# EAGLE design iot_ambilamp_rpi_shield (EAGLE 8.5.0)
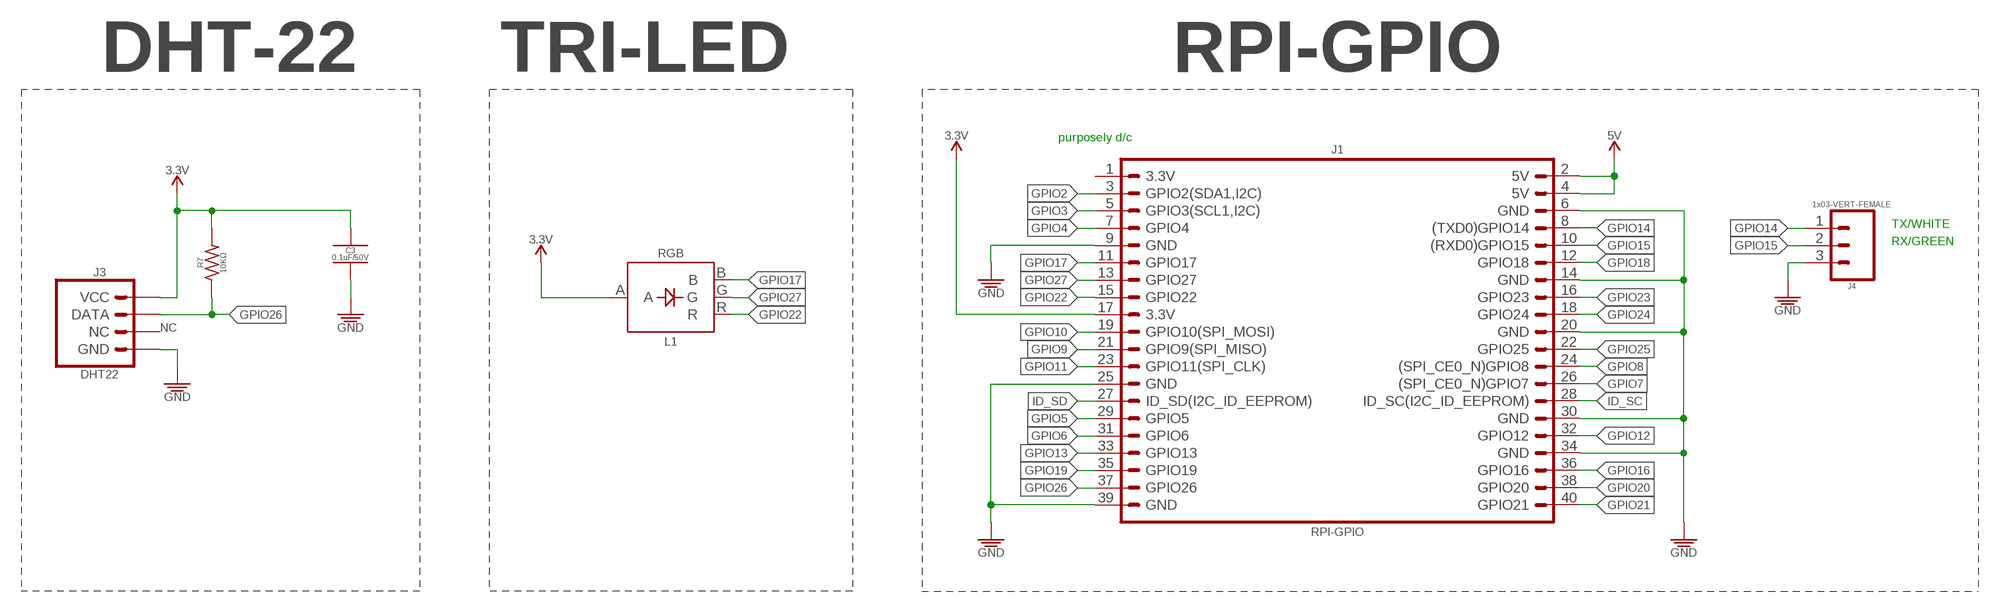
[diagram p0: schematic, sheet 1, part 1 of 2]
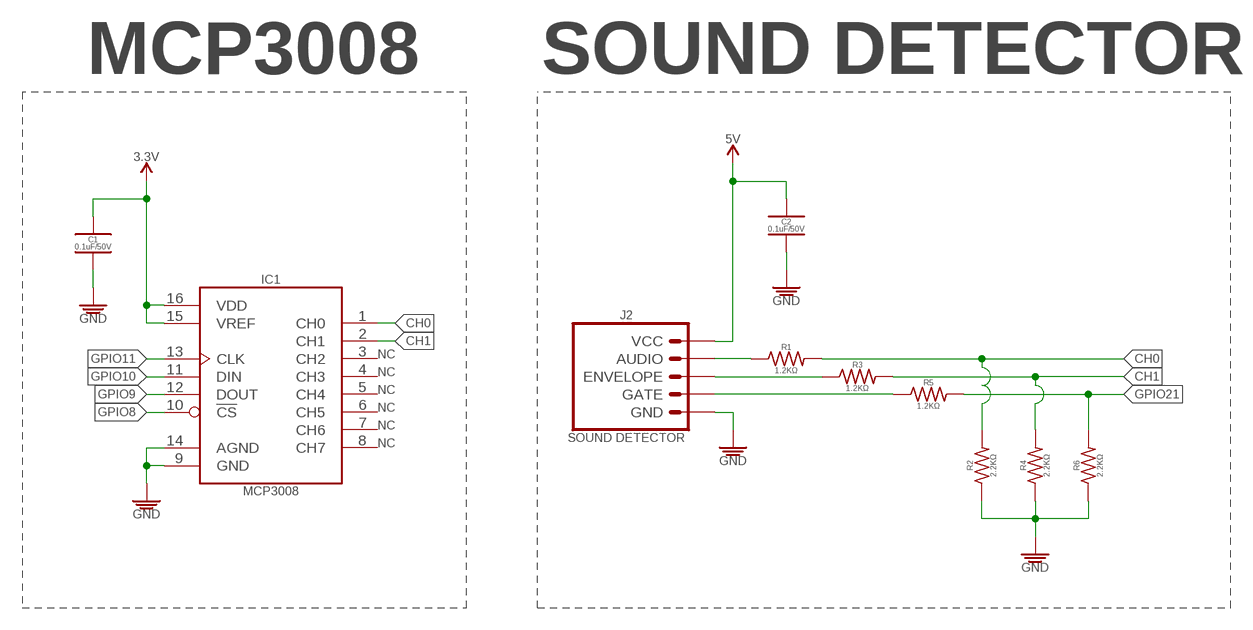
[diagram p1: schematic, sheet 1, part 2 of 2]

## Parts
C1  0.1uF/50V  0.1UF_SMD-805_50V-10%  [_CER_SMD-805]
C2  0.1uF/50V  0.1UF_SMD-805_50V-10%  [_CER_SMD-805]
C3  0.1uF/50V  0.1UF_SMD-805_50V-10%  [_CER_SMD-805]
IC1  MCP3008  MCP3008SO-16  [SO-16]
J1  RPI-GPIO  RPI-GPIO_CONNECTOR  [RPI-GPIO_CONNECTOR_TALL]
J2  SOUND DETECTOR  SOUND-DETECTOR_SPARKFUN  [CONNECTOR-RA_SOUND-DETECTOR_SPARKFUN]
J3  DHT22  TEMPERATURE-SENSOR_DHT22  [CONNECTOR_TEMPERATURE-SENSOR_DHT22]
J4  1x03-VERT-FEMALE  1X03_VERT-FEMALE  [1X03-VERT-FEMALE]
L1  RGB  LED-5MM-PTH_RGB-CA  [LED-5MM-PTH_RGB-CA]
R1  1.2KΩ  1.2KΩ_SMD-0805_1/8W-5%  [RESISTOR_SMD-805]
R2  2.2KΩ  2.2KΩ_SMD-0805_1/8W-5%  [RESISTOR_SMD-805]
R3  1.2KΩ  1.2KΩ_SMD-0805_1/8W-5%  [RESISTOR_SMD-805]
R4  2.2KΩ  2.2KΩ_SMD-0805_1/8W-5%  [RESISTOR_SMD-805]
R5  1.2KΩ  1.2KΩ_SMD-0805_1/8W-5%  [RESISTOR_SMD-805]
R6  2.2KΩ  2.2KΩ_SMD-0805_1/8W-5%  [RESISTOR_SMD-805]
R7  10KΩ  10KΩ_SMD-0805_1/8W-5%  [RESISTOR_SMD-805]

## Nets
3.3V: C1.1 C3.1 IC1.15(VREF) IC1.16(VDD) J1.17(3.3V) J3.VCC L1.A R7.2
5V: C2.1 J1.2(5V) J1.4(5V) J2.VCC
CH0: IC1.1(CH0) R1.2 R2.2
CH1: IC1.2(CH1) R3.2 R4.2
GND: C1.2 C2.2 C3.2 IC1.9(GND) IC1.14(AGND) J1.6(GND) J1.9(GND) J1.14(GND) J1.20(GND) J1.25(GND) J1.30(GND) J1.34(GND) J1.39(GND) J2.GND J3.GND J4.3 R2.1 R4.1 R6.1
GPIO2: J1.3(GPIO2(SDA1,I2C))
GPIO3: J1.5(GPIO3(SCL1,I2C))
GPIO4: J1.7(GPIO4)
GPIO5: J1.29(GPIO5)
GPIO6: J1.31(GPIO6)
GPIO7: J1.26((SPI_CE0_N)GPIO7)
GPIO8: IC1.10(!CS) J1.24((SPI_CE0_N)GPIO8)
GPIO9: IC1.12(DOUT) J1.21(GPIO9(SPI_MISO))
GPIO10: IC1.11(DIN) J1.19(GPIO10(SPI_MOSI))
GPIO11: IC1.13(CLK) J1.23(GPIO11(SPI_CLK))
GPIO12: J1.32(GPIO12)
GPIO13: J1.33(GPIO13)
GPIO14: J1.8((TXD0)GPIO14) J4.1
GPIO15: J1.10((RXD0)GPIO15) J4.2
GPIO16: J1.36(GPIO16)
GPIO17: J1.11(GPIO17) L1.B
GPIO18: J1.12(GPIO18)
GPIO19: J1.35(GPIO19)
GPIO20: J1.38(GPIO20)
GPIO21: J1.40(GPIO21) R5.2 R6.2
GPIO22: J1.15(GPIO22) L1.R
GPIO23: J1.16(GPIO23)
GPIO24: J1.18(GPIO24)
GPIO25: J1.22(GPIO25)
GPIO26: J1.37(GPIO26) J3.DATA R7.1
GPIO27: J1.13(GPIO27) L1.G
ID_SC: J1.28(ID_SC(I2C_ID_EEPROM))
ID_SD: J1.27(ID_SD(I2C_ID_EEPROM))
N$5: J2.GATE R5.1
N$6: J2.ENVELOPE R3.1
N$7: J2.AUDIO R1.1
Unconnected: IC1.3(CH2) IC1.4(CH3) IC1.5(CH4) IC1.6(CH5) IC1.7(CH6) IC1.8(CH7) J1.1(3.3V) J3.NC

## Notes on the sheet
- DHT-22 | TRI-LED | RPI-GPIO | MCP3008 | SOUND DETECTOR
- purposely d/c
- TX/WHITE
- RX/GREEN
- NC
- NC
- NC
- NC
- NC
- NC

## Library data of the parts
C1-C3 = PiB_capacitors:0.1UF; CREATOR: MrSwirlyEyes; DATASHEET: http://psearch.en.murata.com/capacitor/product/GRM21BR71H104KA01%23.pdf; DIST: Digikey; DISTLINK: https://www.digikey.com/products/en?keywords=490-1666-1-ND; DISTPN: 490-1666-1-ND; MFR: Murata Electronics North America; MPN: GRM21BR71H104KA01L; TESTED: NO
IC1 = PiB:MCP3008; CREATOR: MrSwirlyEyes; DATASHEET: http://ww1.microchip.com/downloads/en/DeviceDoc/21295d.pdf; DIST: Digikey; DISTLINK: https://www.digikey.com/products/en?keywords=MCP3008-I%2FSL-ND; DISTPN: MCP3008-I/SL-ND; MFR: Microchip Technology; MPN: MCP3008-I/SL; TESTED: NO
J1 = PiB_connectors:RPI-GPIO_CONNECTOR; CREATOR: MrSwirlyEyes; DATASHEET: https://media.digikey.com/pdf/Data%20Sheets/Sparkfun%20PDFs/PRT-14017_Web.pdf; DIST: Digikey; DISTLINK: https://www.digikey.com/products/en?keywords=1568-1462-ND; DISTPN: 1568-1462-ND; MFR: Sparkfun Electronics; MPN: PRT-14017; TESTED: NO
J2 = lib_swirly:SOUND-DETECTOR_SPARKFUN; CREATOR: MrSwirlyEyes; DATASHEET: https://learn.sparkfun.com/tutorials/sound-detector-hookup-guide; DATASHEET_CONNECTOR: http://www.sullinscorp.com/catalogs/77_PAGE108-109_.100_MALE_HDR.pdf; DIST: Digikey; DISTLINK: https://www.digikey.com/products/en?keywords=1568-1290-ND; DISTLINK_CONNECTOR: https://www.digikey.com/products/en?keywords=PEC05SAAN; DISTPN: 1568-1290-ND; DISTPN_CONNECTOR: S1012E-05-ND; DIST_CONNECTOR: Digikeu; MFR: Sparkfun; MFR_CONNECTOR: Sullins Connector Solutions; MPN: SEN-12642; MPN_CONNECTOR: PEC05SAAN; TESTED: NO
J3 = PiB:TEMPERATURE-SENSOR_DHT22; CREATOR: MrSwirlyEyes; DATASHEET: https://cdn-shop.adafruit.com/datasheets/DHT22.pdf; DIST: Sparkfun; DISTLINK: https://www.sparkfun.com/products/10167; DISTPN: SEN-10167; MFR: MaxDetect Technology Co., Ltd.; MPN: RHT03; TESTED: NO
J4 = PiB_connectors:1X03; CREATOR: MrSwirlyEyes; DATASHEET: http://sullinscorp.com/catalogs/101_PAGE114-115_.100_FEMALE_HDR.pdf; DIST: Digikey; DISTLINK: https://www.digikey.com/products/en?keywords=PPTC031LFBN-RC; DISTPN: S7001-ND; MFR: Sullins Connector Solutions; MPN: PPTC031LFBN-RC; TESTED: NO
L1 = PiB_leds:LED-5MM-PTH_RGB-CA; CREATOR: MrSwirlyEyes; DATASHEET: https://cdn.sparkfun.com/datasheets/Components/LED/YSL-R596AR3G4B5C-C10.pdf; DIST: Sparkfun; DISTLINK: https://www.sparkfun.com/products/10820; DISTPN: COM-10820; MFR: SunLED; MPN: YSL-R596AR3G4B5C-C10; TESTED: NO
R1 R3 R5 = PiB_resistors:1.2KΩ; CREATOR: MrSwirlyEyes; DATASHEET: http://www.yageo.com/documents/recent/PYu-RC_Group_51_RoHS_L_7.pdf; DIST: Digikey; DISTLINK: https://www.digikey.com/product-detail/en/yageo/RC0805JR-071K2L/311-1.2KARCT-ND/731171; DISTPN: 311-1.2KARCT-ND; MFR: Yageo; MPN: RC0805JR-071K2L; TESTED: NO
R2 R4 R6 = PiB_resistors:2.2KΩ; CREATOR: MrSwirlyEyes; DATASHEET: http://www.yageo.com/documents/recent/PYu-RC_Group_51_RoHS_L_7.pdf; DIST: Digikey; DISTLINK: https://www.digikey.com/product-detail/en/yageo/RC0805JR-072K2L/311-2.2KARCT-ND/731218; DISTPN: 311-2.2KARCT-ND; MFR: Yageo; MPN: RC0805JR-072K2L; TESTED: NO
R7 = PiB_resistors:10KΩ; CREATOR: Kenmei; DATASHEET: http://www.yageo.com/documents/recent/PYu-RC_Group_51_RoHS_L_7.pdf; DIST: Digikey; DISTLINK: https://www.digikey.com/products/en?keywords=311-10KARCT-ND; DISTPN: 311-10KARCT-ND; MFR: Yageo; MPN: RC0805JR-0710KL; TESTED: YES

## Board
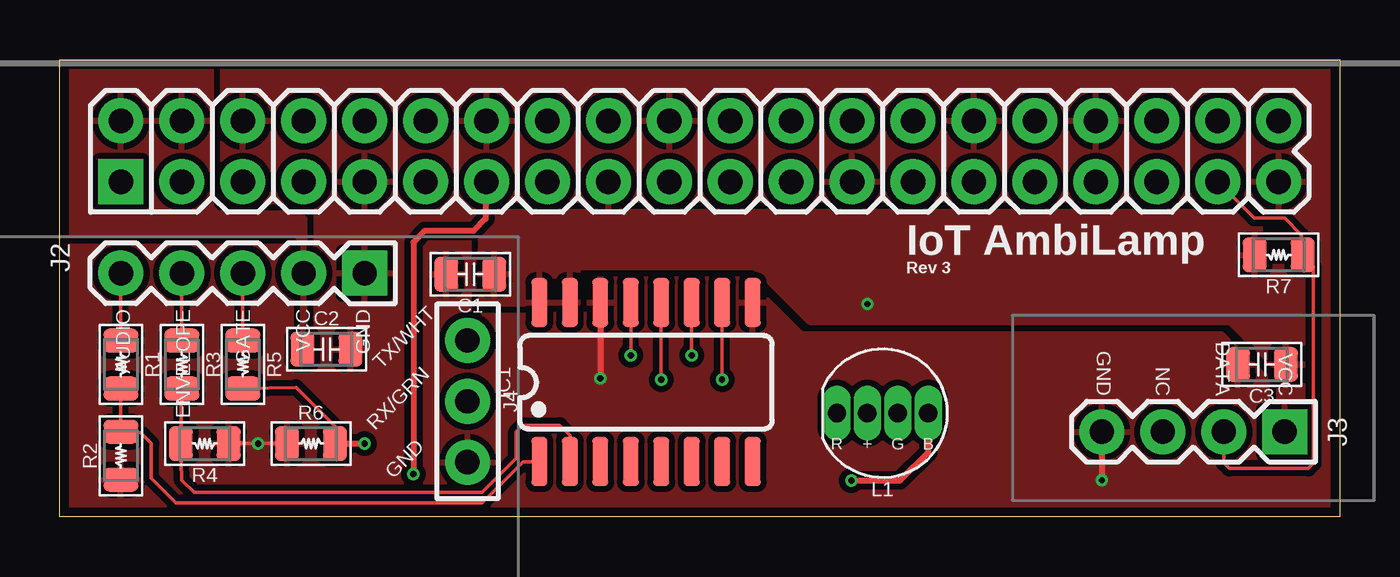
[diagram p2: board, top side]
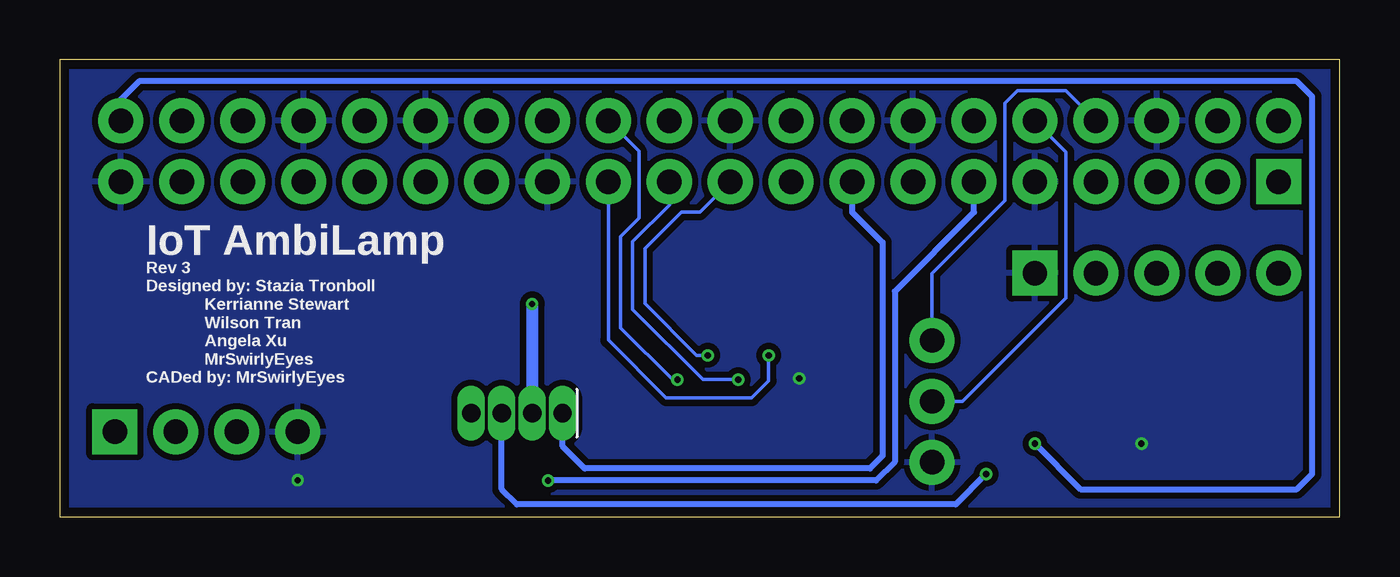
[diagram p3: board, bottom side, seen from below]

Size 53.34 x 19.05 mm. Coordinates in mm from the lower left corner, seen from the top.
Outline: 0,0 0,19.05 53.34,19.05 53.34,0 0,0
Copper layers (1*16): Top 0.035559375mm / dielectric 1.6mm / Bottom 0.035559375mm
Design rules "oshpark-2layer": minimum track width 6mil, minimum drill 10mil, track to track 6mil, track to pad 6mil, pad to pad 6mil, via to via 6mil, smd to smd 6mil, copper to edge 15mil, drill to drill 6mil, minimum pad ring 5mil, minimum via ring 5mil, stop-mask expansion 2.5mil, vias tented up to drill 0mil, thermal gap 10mil

### Footprints (pad centres in the part's own frame; a part is rotated, then mirrored left to right if it is on the bottom)
_CER_SMD-805 = smd 1 x 1.45: 1 -1,0; 2 1,0
SO-16 = smd 2.032 x 0.66: 1 -3.285,4.145; 2 -3.285,2.875; 3 -3.285,1.605; 4 -3.285,0.335; 5 -3.285,-0.935; 6 -3.285,-2.205; 7 -3.285,-3.475; 8 -3.285,-4.745; 9 3.345,-4.745; 10 3.345,-3.475; 11 3.345,-2.205; 12 3.345,-0.935; 13 3.345,0.335; 14 3.345,1.605; 15 3.345,2.875; 16 3.345,4.145
RPI-GPIO_CONNECTOR_TALL = drill 1.016 pad 1.88 square: 1 -24.13,-1.27 | drill 1.016 pad 1.88: 2 -24.13,1.27; 3 -21.59,-1.27; 4 -21.59,1.27; 5 -19.05,-1.27; 6 -19.05,1.27; 7 -16.51,-1.27; 8 -16.51,1.27; 9 -13.97,-1.27; 10 -13.97,1.27; 11 -11.43,-1.27; 12 -11.43,1.27; 13 -8.89,-1.27; 14 -8.89,1.27; 15 -6.35,-1.27; 16 -6.35,1.27; 17 -3.81,-1.27; 18 -3.81,1.27; 19 -1.27,-1.27; 20 -1.27,1.27; 21 1.27,-1.27; 22 1.27,1.27; 23 3.81,-1.27; 24 3.81,1.27; 25 6.35,-1.27; 26 6.35,1.27; 27 8.89,-1.27; 28 8.89,1.27; 29 11.43,-1.27; 30 11.43,1.27; 31 13.97,-1.27; 32 13.97,1.27; 33 16.51,-1.27; 34 16.51,1.27; 35 19.05,-1.27; 36 19.05,1.27; 37 21.59,-1.27; 38 21.59,1.27; 39 24.13,-1.27; 40 24.13,1.27
CONNECTOR-RA_SOUND-DETECTOR_SPARKFUN = drill 1.016 pad 1.88: AUDIO 0,5.08; ENVELOPE 0,2.54; GATE 0,0; VCC 0,-2.54 | drill 1.016 pad 1.88 square: GND 0,-5.08
CONNECTOR_TEMPERATURE-SENSOR_DHT22 = drill 1.016 pad 1.88: DATA -1,1.27; GND -1,-3.81; NC -1,-1.27 | drill 1.016 pad 1.88 square: VCC -1,3.81
1X03-VERT-FEMALE = drill 1.016 pad 1.88: 1 -2.54,0; 2 0,0; 3 2.54,0
LED-5MM-PTH_RGB-CA = drill 0.762 pad 0.787 long: A 0.635,0; B -1.905,0; G -0.635,0; R 1.905,0
RESISTOR_SMD-805 = smd 1 x 1.45: 1 -1,0; 2 1,0

### Placement (x,y rotation side)
C1  17.11,10.11 180 top
C2  11.11,6.99 0 top
C3  50.1,6.35 180 top
IC1  24.13,5.59 90 top
J1  26.67,15.24 0 top
J2  7.62,10.16 90 top
J3  47.24,2.54 270 top
J4  16.99,4.81 270 top
L1  34.29,4.32 180 top
R1  2.54,6.35 270 top
R2  2.54,2.54 90 top
R3  5.08,6.35 270 top
R4  6.03,3.05 180 top
R5  7.62,6.35 270 top
R6  10.46,3.05 0 top
R7  50.8,10.92 180 top

### Tracks (layer width: path | path; a pad name or v marks a point on that pad's centre or on a via)
3.3V  (via drill 0.25)
  Bottom 0.508: v33.66,8.87 L1.A
  pour Top (isolate 0.254): 22.61,14.48 22.61,12.7 17.53,12.7 17.53,8.89 21.59,8.89 21.59,10.41 28.96,10.41 31.24,8.13 48.77,8.13 50.8,6.1 50.8,3.05 51.82,3.05 51.82,10.41 50.04,10.41 50.04,12.7 23.11,12.7 23.11,14.48
5V
  pour Top (isolate 0.254): -1.21,11.7 9.83,11.68 10.08,11.43 10.08,6.86 10.24,6.86 10.24,12.45 9.91,12.7 6.6,12.7 6.35,12.95 6.35,20.32 -1.24,20.32
CH0
  Top 0.152: R1.2 R2.2 3.36,3.5 3.81,3.05 3.81,1.6 4.83,0.58 17.6,0.58 19.3,2.29 19.97,2.29 IC1.1
CH1
  Top 0.152: R4.2 5.33,3.24 | IC1.2 21.25,3.38 20.83,3.81 19.29,3.81 19.02,3.54 19.02,2.43 17.6,1.02 5.59,1.02 5.08,1.53 R4.2 | R3.2 5.08,5.39 R4.2
GND  (via drill 0.25)
  Top 0.152: R6.1 v8.25,3.05 R4.1
  Top 0.254: J3.GND v43.43,1.52 | 22.61,8.89 IC1.14 v22.53,5.76
  Bottom 0.254: v22.53,5.76 22.44,5.84
  pour Top (isolate 0.254, rank 2): -2.54,21.59 -2.54,-2.54 55.88,-2.54 55.88,21.59
  pour Bottom (isolate 0.254, rank 2): -5.08,24.13 58.42,24.13 58.42,-5.08 -5.08,-5.08
GPIO8  (via drill 0.25)
  Top 0.152: v27.61,5.71 IC1.10
  Bottom 0.152: J1.24 29.21,15.24 29.21,12.45 29.97,11.68 29.97,7.87 27.81,5.71 v27.61,5.71
GPIO9  (via drill 0.25)
  Top 0.152: v25.07,5.71 IC1.12
  Bottom 0.152: J1.21 27.94,13.01 29.46,11.48 29.46,8.64 26.54,5.71 v25.07,5.71
GPIO10  (via drill 0.25)
  Top 0.152: IC1.11 v26.34,6.73
  Bottom 0.152: v26.34,6.73 26.8,6.73 28.96,8.89 28.96,11.18 27.43,12.7 26.67,12.7 J1.19
GPIO11  (via drill 0.25)
  Top 0.152: v23.8,6.73 IC1.13
  Bottom 0.152: J1.23 30.48,7.37 28.07,4.95 24.51,4.95 23.8,5.67 v23.8,6.73
GPIO14
  Bottom 0.152: J1.8 11.41,17.76 13.43,17.76 13.94,17.26 13.94,13.19 16.99,10.14 J4.1
GPIO15
  Bottom 0.152: J1.10 11.4,15.21 11.4,9.13 15.72,4.81 J4.2
GPIO17  (via drill 0.25)
  Top 0.254: v32.99,1.51 35.02,1.51 36.2,2.68 L1.B
  Bottom 0.254: J1.11 15.24,12.7 18.54,9.4 18.54,2.29 19.32,1.51 v32.99,1.51
GPIO21  (via drill 0.25)
  Top 0.152: 7.81,5.59 R5.2 9.84,5.39 11.42,3.81 R6.2
  Top 0.254: R6.2 v12.7,3.05
  Bottom 0.254: v12.7,3.05 10.79,1.14 1.78,1.14 1.14,1.78 1.14,17.53 1.78,18.16 50.04,18.16 50.8,17.4 J1.40
GPIO22
  Bottom 0.254: J1.15 20.32,12.71 19.05,11.44 19.05,2.54 19.57,2.02 31.47,2.02 32.38,2.94 L1.R
GPIO26
  Top 0.152: J1.37 49.78,12.45 51.05,12.45 51.76,11.74 R7.1 52.25,10.43 52.25,2.22 52.04,2.02 48.74,2.02 48.51,2.24 J3.DATA
GPIO27  (via drill 0.25)
  Top 0.254: J1.13 17.75,13.94 17.75,12.43 17.24,11.92 15.21,11.92 14.73,11.44 v14.73,1.78
  Bottom 0.254: v14.73,1.78 16,0.51 34.29,0.51 34.92,1.14 L1.G
N$5
  Top 0.152: R5.1 J2.GATE
N$6
  Top 0.152: J2.ENVELOPE R3.1
N$7
  Top 0.152: R1.1 J2.AUDIO

### Text on the board
tPlace: IoT AmbiLamp | Rev 3 | TX/WHT | RX/GRN | GND
bPlace: IoT AmbiLamp | Rev 3 / Designed by: Stazia Tronboll / Kerrianne Stewart / Wilson Tran / Angela Xu / MrSwirlyEyes / CADed by: MrSwirlyEyes